# EAGLE schematic projekt_główny (1) (EAGLE 9.6.2)

## Sheet 1 of 2
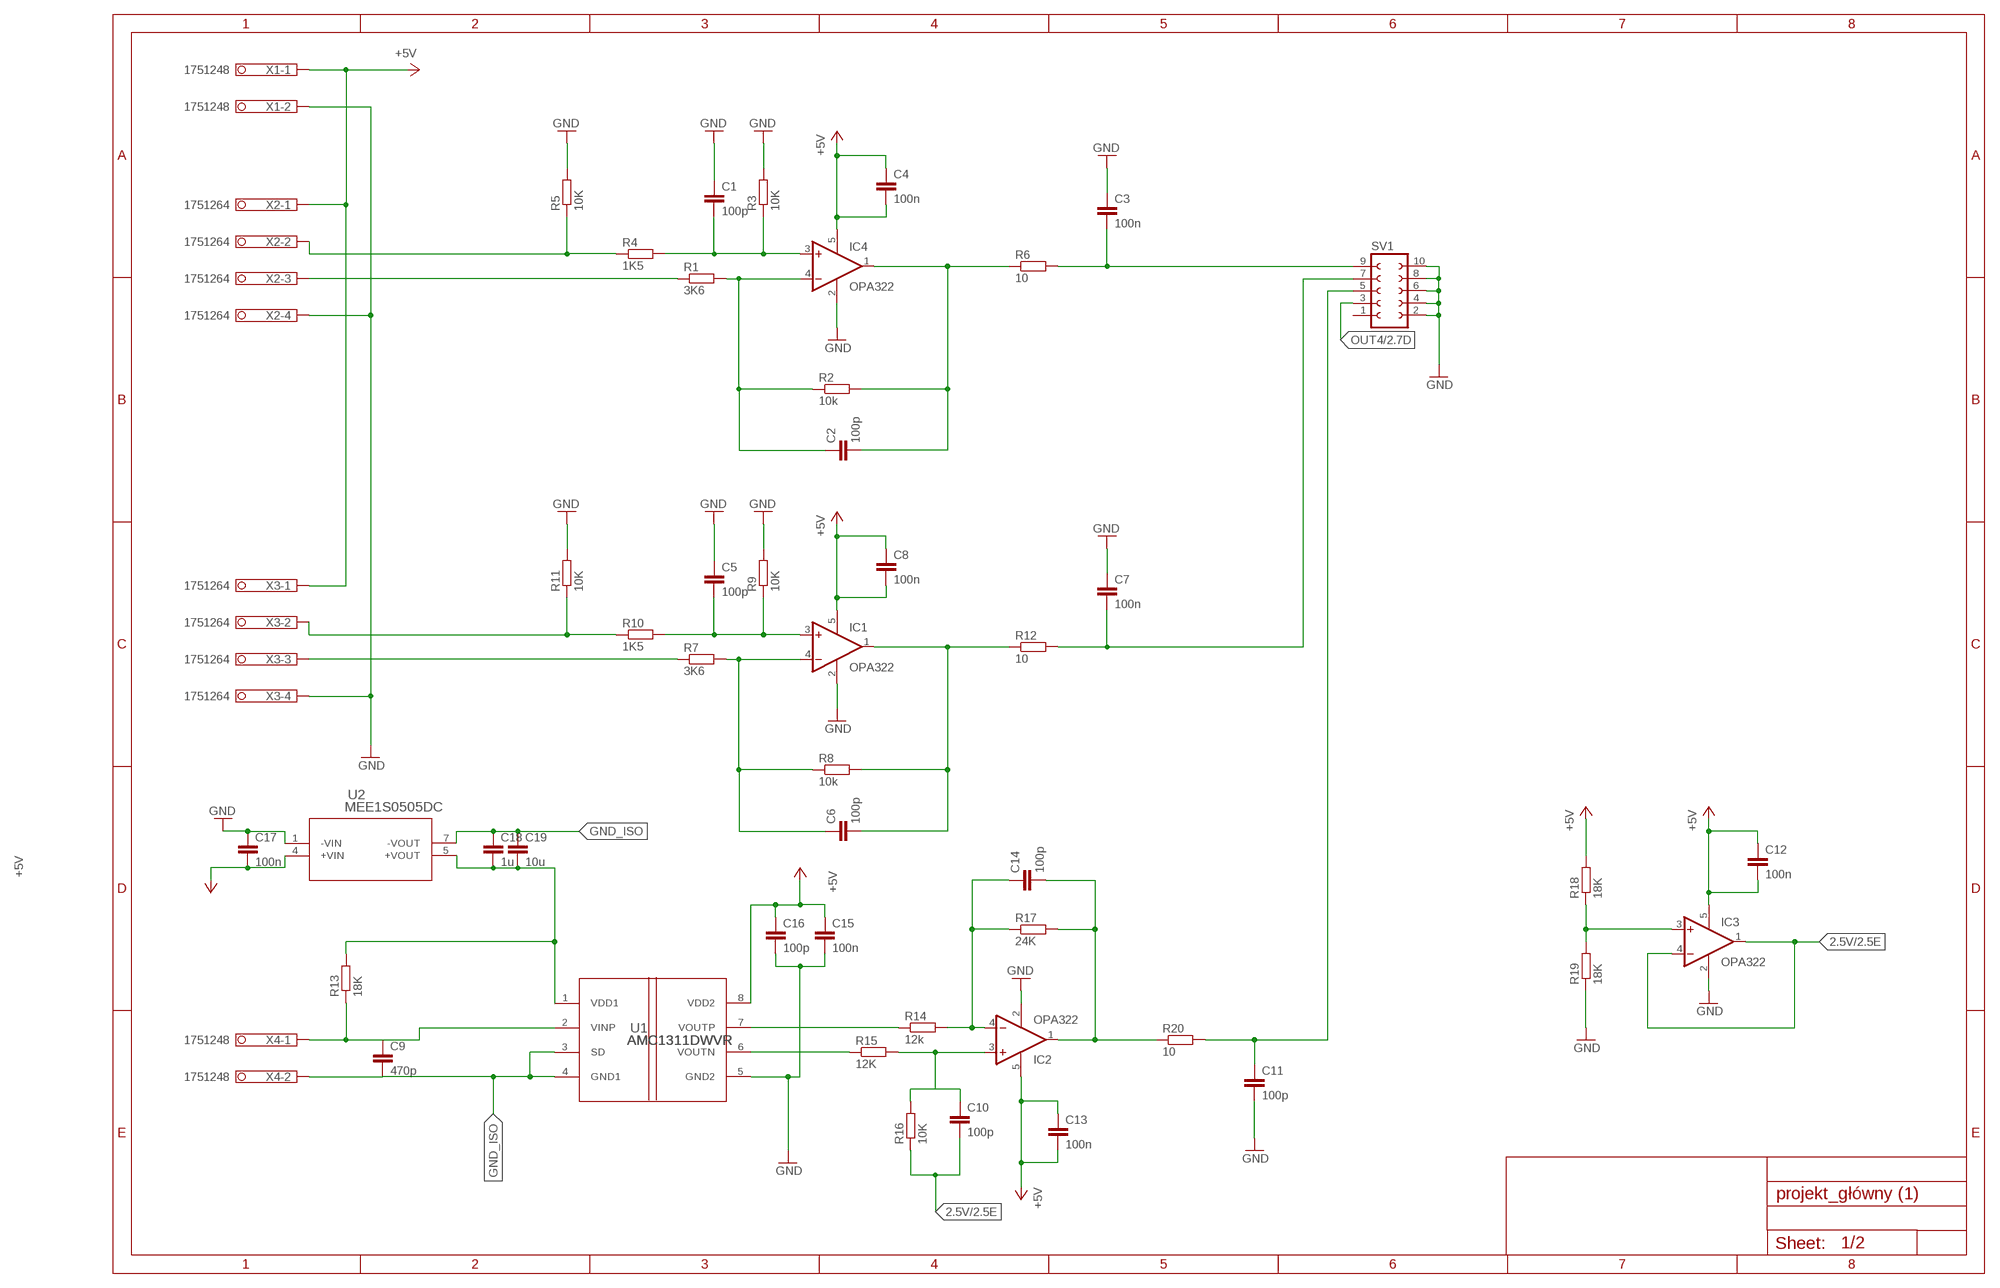
[diagram p0: schematic, sheet 1]

### Parts
C1  100p  C-EUC0603  [C0603]
C2  100p  C-EUC0603  [C0603]
C3  100n  C-EUC0603  [C0603]
C4  100n  C-EUC0603  [C0603]
C5  100p  C-EUC0603  [C0603]
C6  100p  C-EUC0603  [C0603]
C7  100n  C-EUC0603  [C0603]
C8  100n  C-EUC0603  [C0603]
C9  470p  C-EUC0603  [C0603]
C10  100p  C-EUC0603  [C0603]
C11  100p  C-EUC0603  [C0603]
C12  100n  C-EUC0603  [C0603]
C13  100n  C-EUC0603  [C0603]
C14  100p  C-EUC0603  [C0603]
C15  100n  C-EUC0603  [C0603]
C16  100p  C-EUC0603  [C0603]
C17  100n  C-EUC0603  [C0603]
C18  1u  C-EUC0603  [C0603]
C19  10u  C-EUC0603  [C0603]
IC1  OPA322  OPA333DBV  [SOT23-5]
IC2  OPA322  OPA333DBV  [SOT23-5]
IC3  OPA322  OPA333DBV  [SOT23-5]
IC4  OPA322  OPA333DBV  [SOT23-5]
R1  3K6  R-EU_R0805  [R0805]
R2  10k  R-EU_R0805  [R0805]
R3  10K  R-EU_R0805  [R0805]
R4  1K5  R-EU_R0805  [R0805]
R5  10K  R-EU_R0805  [R0805]
R6  10  R-EU_R0805  [R0805]
R7  3K6  R-EU_R0805  [R0805]
R8  10k  R-EU_R0805  [R0805]
R9  10K  R-EU_R0805  [R0805]
R10  1K5  R-EU_R0805  [R0805]
R11  10K  R-EU_R0805  [R0805]
R12  10  R-EU_R0805  [R0805]
R13  18K  R-EU_R0805  [R0805]
R14  12k  R-EU_R0805  [R0805]
R15  12K  R-EU_R0805  [R0805]
R16  10K  R-EU_R0805  [R0805]
R17  24K  R-EU_R0805  [R0805]
R18  18K  R-EU_R0805  [R0805]
R19  18K  R-EU_R0805  [R0805]
R20  10  R-EU_R0805  [R0805]
SV1  FE05-2  [FE05-2]
U1  AMC1311DWVR  [DWV0008A]
U2  MEE1S0505DC  MEE1S0305DC  [MEE1S0305DC_MUR]
X1  1751248  [1751248]
X2  1751264  [1751264]
X3  1751264  [1751264]
X4  1751248  [1751248]

### Nets
2.5V: C10.2 IC3.1(OUT) IC3.4(-IN) R16.1 ; also sheet 2
+5V: C4.1 C4.2 C8.1 C8.2 C12.1 C12.2 C13.1 C13.2 C15.1 C16.1 C17.2 IC1.5(V+) IC2.5(V+) IC3.5(V+) IC4.5(V+) R18.2 U1.8(VDD2) U2.4(+VIN) X1.1 X2.1 X3.1 ; also sheet 2
GND: C1.1 C3.1 C5.1 C7.1 C11.2 C15.2 C16.2 C17.1 IC1.2(V-) IC2.2(V-) IC3.2(V-) IC4.2(V-) R3.2 R5.2 R9.2 R11.2 R19.1 SV1.2 SV1.4 SV1.6 SV1.8 SV1.10 U1.5(GND2) U2.1(-VIN) X1.2 X2.4 X3.4 ; also sheet 2
GND_ISO: C9.2 C18.1 C19.1 U1.3(SD) U1.4(GND1) U2.7(-VOUT) X4.2
N$1: C2.1 IC4.4(-IN) R1.2 R2.1
N$2: R1.1 X2.3
N$3: C2.2 IC4.1(OUT) R2.2 R6.1
N$4: C1.2 IC4.3(+IN) R3.1 R4.2
N$5: R4.1 R5.1 X2.2
N$6: C3.2 R6.2 SV1.9
N$7: C6.1 IC1.4(-IN) R7.2 R8.1
N$8: R7.1 X3.3
N$9: C6.2 IC1.1(OUT) R8.2 R12.1
N$10: C5.2 IC1.3(+IN) R9.1 R10.2
N$11: R10.1 R11.1 X3.2
N$12: C7.2 R12.2 SV1.7
N$13: C9.1 R13.1 U1.2(VINP) X4.1
N$14: C14.1 IC2.4(-IN) R14.2 R17.1
N$15: IC3.3(+IN) R18.1 R19.2
N$16: R15.1 U1.6(VOUTN)
N$17: R14.1 U1.7(VOUTP)
N$18: C11.1 R20.2 SV1.5
N$19: C14.2 IC2.1(OUT) R17.2 R20.1
N$20: C10.1 IC2.3(+IN) R15.2 R16.2
N$23: C18.2 C19.2 R13.2 U1.1(VDD1) U2.5(+VOUT)
OUT4: SV1.3 ; also sheet 2
Unconnected: SV1.1

## Sheet 2 of 2
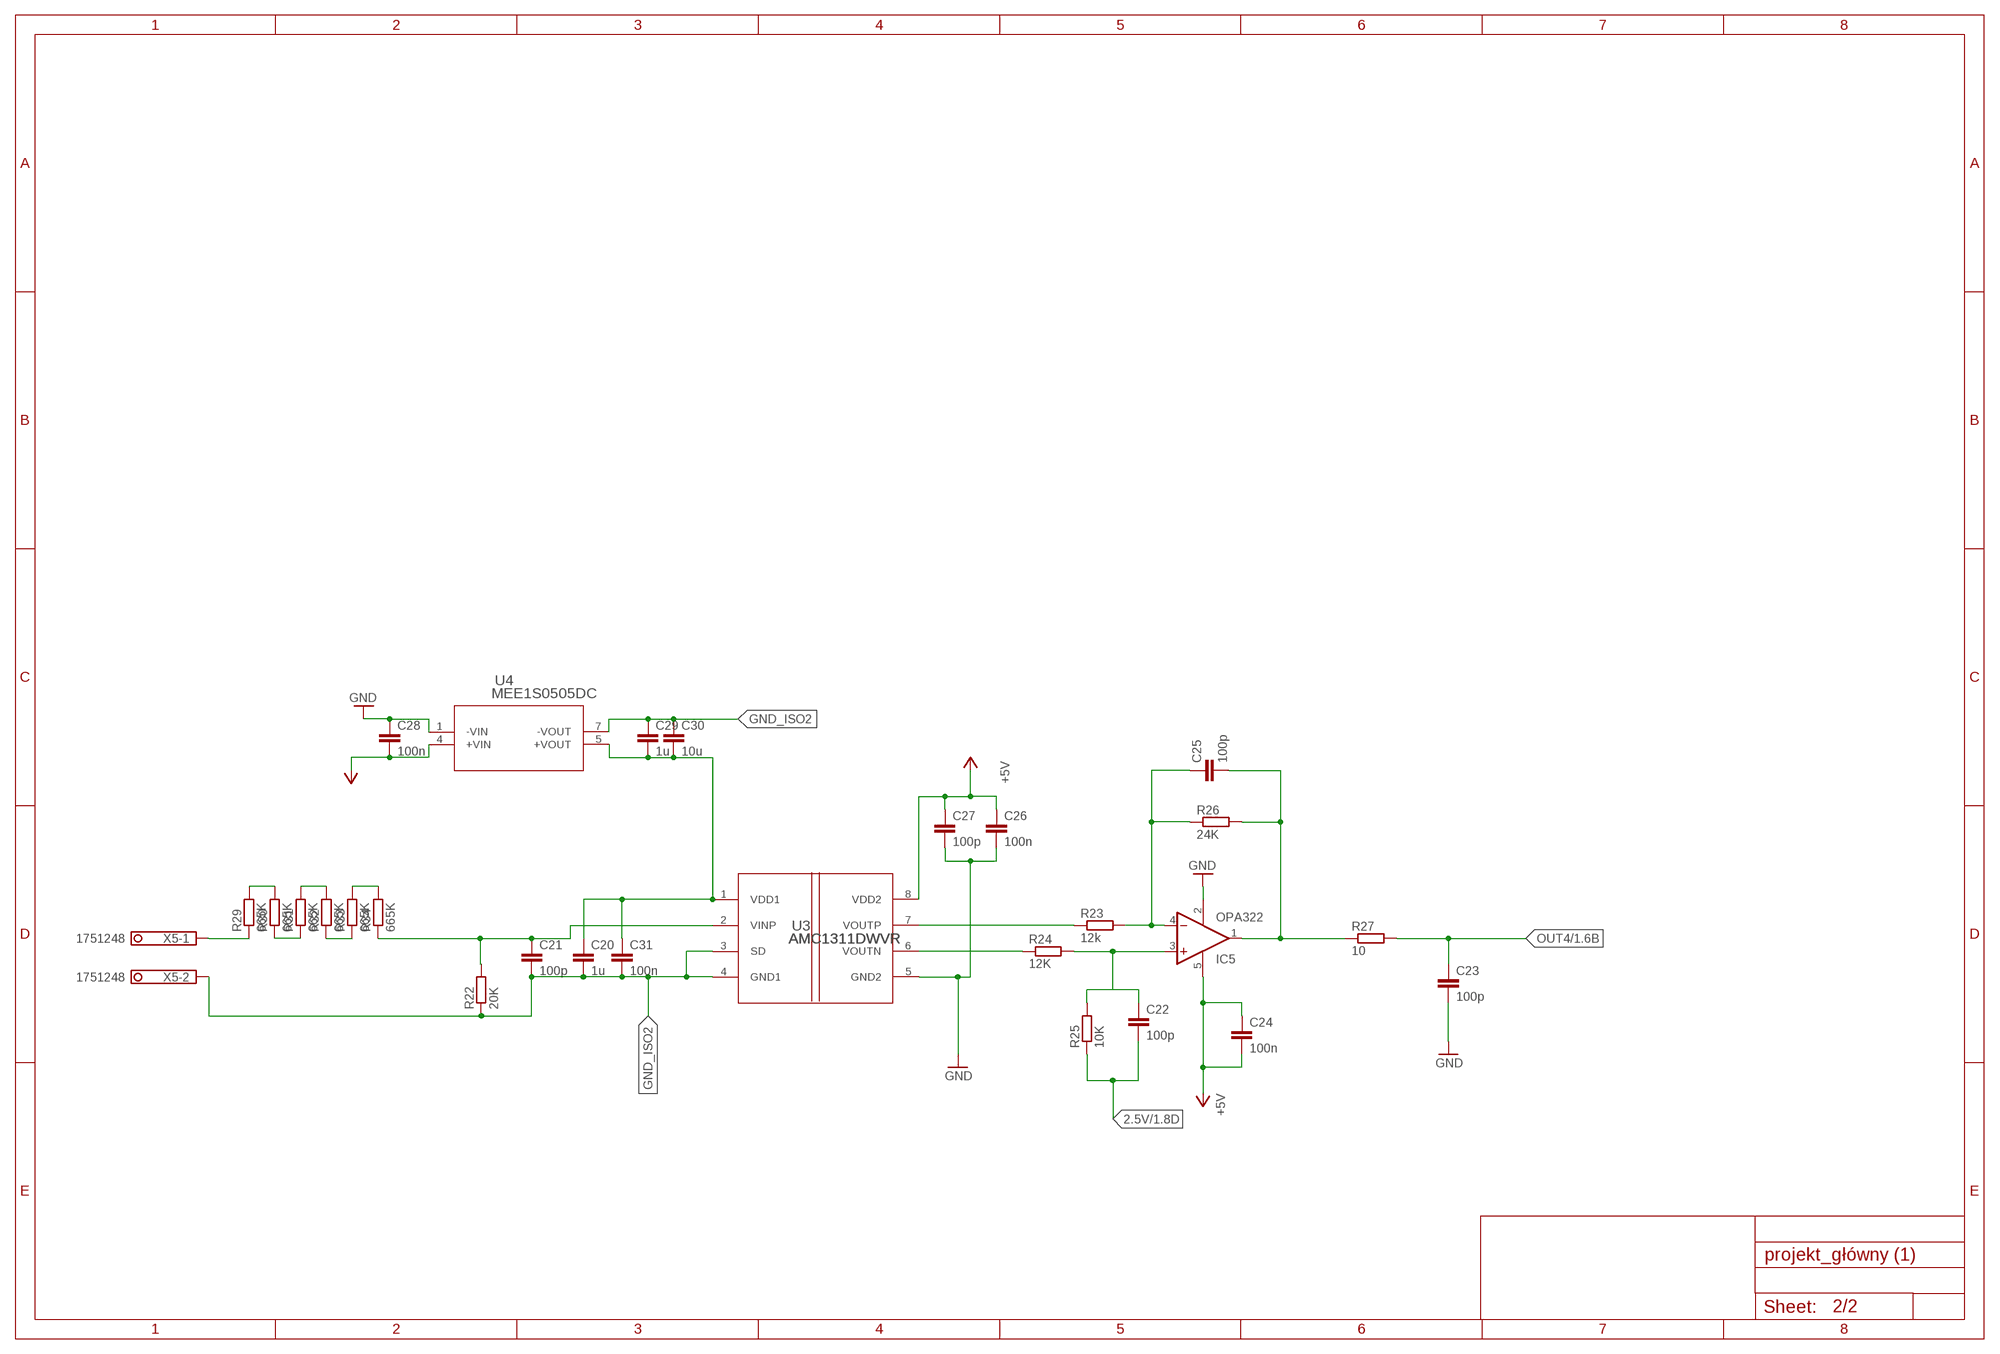
[diagram p1: schematic, sheet 2]

### Parts
C20  1u  C-EUC0603  [C0603]
C21  100p  C-EUC0603  [C0603]
C22  100p  C-EUC0603  [C0603]
C23  100p  C-EUC0603  [C0603]
C24  100n  C-EUC0603  [C0603]
C25  100p  C-EUC0603  [C0603]
C26  100n  C-EUC0603  [C0603]
C27  100p  C-EUC0603  [C0603]
C28  100n  C-EUC0603  [C0603]
C29  1u  C-EUC0603  [C0603]
C30  10u  C-EUC0603  [C0603]
C31  100n  C-EUC0603  [C0603]
IC5  OPA322  OPA333DBV  [SOT23-5]
R22  20K  R-EU_R0805  [R0805]
R23  12k  R-EU_R0805  [R0805]
R24  12K  R-EU_R0805  [R0805]
R25  10K  R-EU_R0805  [R0805]
R26  24K  R-EU_R0805  [R0805]
R27  10  R-EU_R0805  [R0805]
R29  665K  R-EU_R0805  [R0805]
R30  665K  R-EU_R0805  [R0805]
R31  665K  R-EU_R0805  [R0805]
R32  665K  R-EU_R0805  [R0805]
R33  665K  R-EU_R0805  [R0805]
R34  665K  R-EU_R0805  [R0805]
U3  AMC1311DWVR  [DWV0008A]
U4  MEE1S0505DC  MEE1S0305DC  [MEE1S0305DC_MUR]
X5  1751248  [1751248]

### Nets
2.5V: C22.2 R25.1 ; also sheet 1
+5V: C24.1 C24.2 C26.1 C27.1 C28.2 IC5.5(V+) U3.8(VDD2) U4.4(+VIN) ; also sheet 1
GND: C23.2 C26.2 C27.2 C28.1 IC5.2(V-) U3.5(GND2) U4.1(-VIN) ; also sheet 1
GND_ISO2: C20.2 C21.2 C29.1 C30.1 C31.2 R22.1 U3.3(SD) U3.4(GND1) U4.7(-VOUT) X5.2
N$25: C21.1 R22.2 R34.1 U3.2(VINP)
N$26: C25.1 IC5.4(-IN) R23.2 R26.1
N$27: R24.1 U3.6(VOUTN)
N$28: R23.1 U3.7(VOUTP)
N$29: C25.2 IC5.1(OUT) R26.2 R27.1
N$30: C22.1 IC5.3(+IN) R24.2 R25.2
N$32: C20.1 C29.2 C30.2 C31.1 U3.1(VDD1) U4.5(+VOUT)
N$36: R33.2 R34.2
N$37: R32.1 R33.1
N$38: R31.2 R32.2
N$39: R30.1 R31.1
N$40: R29.2 R30.2
N$41: R29.1 X5.1
OUT4: C23.1 R27.2 ; also sheet 1

## Library data of the parts
C1-C31 = rcl:C-EU: CAPACITOR, European symbol; SPICEPREFIX: C
IC1-IC5 = linear:OPA333: 1.8V, microPOWER CMOS OPERATIONAL AMPLIFIERS Zerø-Drift Series Source: Texas Instruments (Burr-Brown) .. U11 opa333 Operational Amp.pdf
R1-R20 R22-R27 R29-R34 = rcl:R-EU_: RESISTOR, European symbol; SPICEPREFIX: R
SV1 = con-lsta:FE05-2: FEMALE HEADER; OC_FARNELL: unknown; OC_NEWARK: unknown
U1 U3 = untitled:AMC1311DWVR; COPYRIGHT: Copyright (C) 2023 Ultra Librarian. All rights reserved.; MANUFACTURER_PART_NUMBER: AMC1311DWVR; MFR_NAME: Texas Instruments; REFDES: RefDes; TYPE: TYPE
U2 U4 = untitled2:MEE1S0305DC; COPYRIGHT: Copyright (C) 2023 Ultra Librarian. All rights reserved.; MANUFACTURER_PART_NUMBER: MEE1S0305DC; MFR_NAME: Murata
X1 X4 X5 = con-phoenix-350:1751248: MKDS 1/ 2-3,5 Printklemme Nennstrom: 10 A Bemessungsspannung: 160 V Raster: 3,5 mm Polzahl: 2 Montageart: Löten Anschlussart: Schraubanschluss Anschlussrichtung vom Leiter zur Platine: 0° Source: http://eshop.phoenixcontact.com .. 1751248.pdf; OC_FARNELL: unknown; OC_NEWARK: unknown
X2 X3 = con-phoenix-350:1751264: MKDS 1/ 4-3,5 Printklemme Nennstrom: 10 A Bemessungsspannung: 160 V Raster: 3,5 mm Polzahl: 4 Montageart: Löten Anschlussart: Schraubanschluss Anschlussrichtung vom Leiter zur Platine: 0° Source: http://eshop.phoenixcontact.com .. 1751264.pdf; MPN: 1751264; OC_FARNELL: unknown; OC_NEWARK: 10R0934